# Altium schematic sheet output_register.schdoc
size 295 x 130 mm
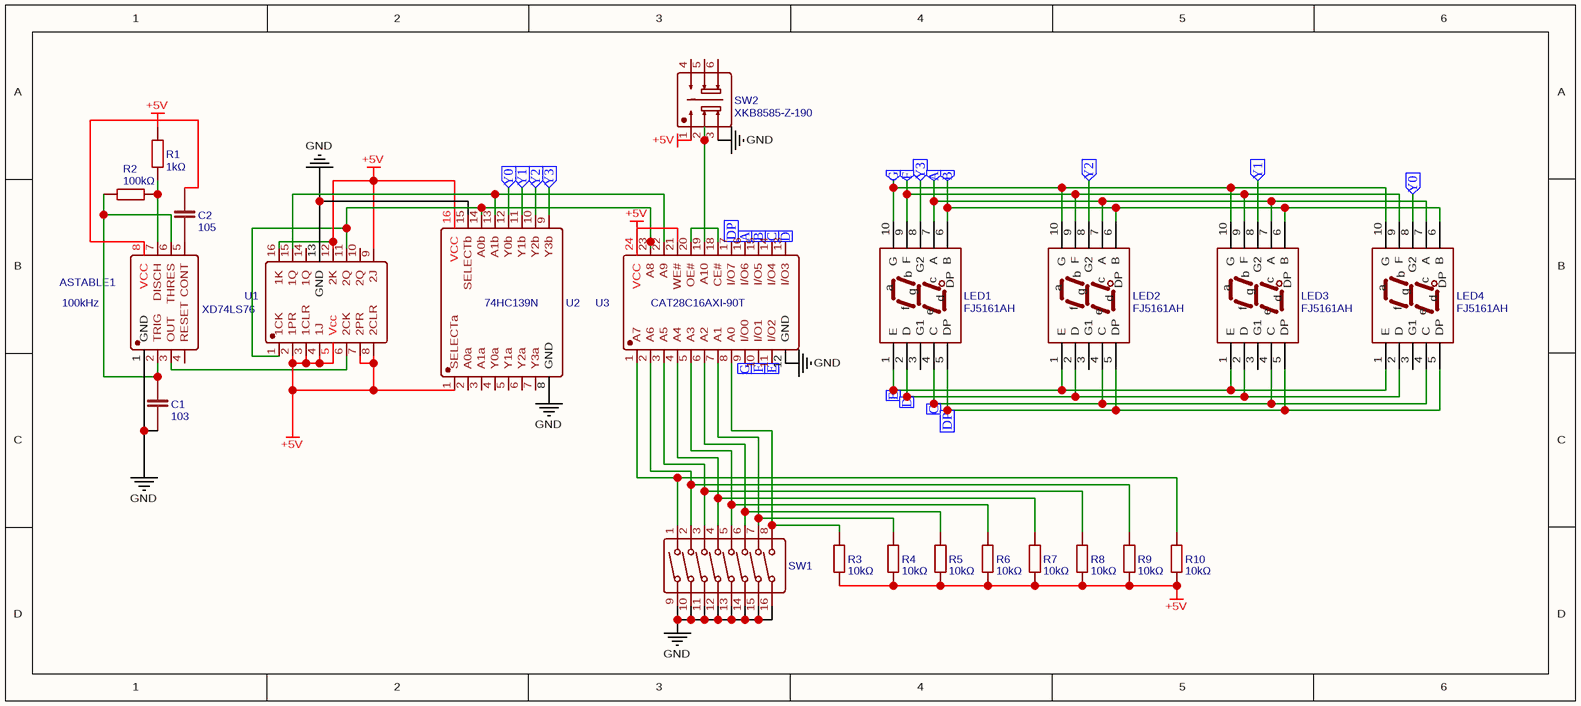
[diagram p0: output_register.schdoc]

## Parts
ASTABLE1  100kHz  [DIP-8_L9.8-W6.6-P2.54-LS7.6-BL]
C1  103  [CAPACITOR CERAMIC TH 0.1]
C2  105  [CAPACITOR CERAMIC TH 0.1]
LED1  FJ5161AH  [LED-SEG-TH_10P-L12.6-W19.0-P2.54-S15.24-BL]
LED2  FJ5161AH  [LED-SEG-TH_10P-L12.6-W19.0-P2.54-S15.24-BL]
LED3  FJ5161AH  [LED-SEG-TH_10P-L12.6-W19.0-P2.54-S15.24-BL]
LED4  FJ5161AH  [LED-SEG-TH_10P-L12.6-W19.0-P2.54-S15.24-BL]
R1  1kΩ  [RES-TH_BD3.3-L9.0-P13.00-D0.6]
R2  100kΩ  [RES-TH_BD3.3-L9.0-P13.00-D0.6]
R3  10kΩ  [RES-TH_BD3.3-L9.0-P13.00-D0.6]
R4  10kΩ  [RES-TH_BD3.3-L9.0-P13.00-D0.6]
R5  10kΩ  [RES-TH_BD3.3-L9.0-P13.00-D0.6]
R6  10kΩ  [RES-TH_BD3.3-L9.0-P13.00-D0.6]
R7  10kΩ  [RES-TH_BD3.3-L9.0-P13.00-D0.6]
R8  10kΩ  [RES-TH_BD3.3-L9.0-P13.00-D0.6]
R9  10kΩ  [RES-TH_BD3.3-L9.0-P13.00-D0.6]
R10  10kΩ  [RES-TH_BD3.3-L9.0-P13.00-D0.6]
SW1  DSWB08LHGET  [SW-TH_DSWB08LHGET]  (value not drawn)
SW2  XKB8585-Z-190  [SW-TH_6P-L8.6-W8.6-P2.50-LS5.4]
U1  XD74LS76  [DIP-16_L19.2-W6.6-P2.54-LS7.6-BL]
U2  74HC139N  [DIP-16_L19.2-W6.6-P2.54-LS7.6-BL]
U3  CAT28C16AXI-90T  [SOIC-24_L15.0-W5.3-P1.27-LS7.8-BL]

## Ports
A (in), B (in), C (in), D (in), DP (in), E (in), F (in), G (in), Y0 (in), Y1 (in), Y2 (in), Y3 (in)

## Nets
+5V: R1.2 R3.2 R4.2 R5.2 R6.2 R7.2 R8.2 R9.2 R10.2 SW2.1 U1.2(1PR) U1.3(1CLR) U1.4(1J) U1.5(Vcc) U1.7(2PR) U1.8(2CLR) U1.9(2J) U1.12(2K) U1.16(1K) U2.1(SELECTa) U2.16(VCC) U3.24(VCC)
GND: ASTABLE1.1(GND) C1.1 SW1.9 SW1.10 SW1.11 SW1.12 SW1.13 SW1.14 SW1.15 SW1.16 SW2.3 U1.1(1CK) U1.11(2Q) U1.13(GND) U2.8(GND) U2.14(A0b) U2.15(SELECTb) U3.12(GND) U3.23(A8)
A: LED1.7(A) LED2.7(A) LED3.7(A) LED4.7(A) U3.16(I/O6) ; port A
B: LED1.6(B) LED2.6(B) LED3.6(B) LED4.6(B) U3.15(I/O5) ; port B
C: LED1.4(C) LED2.4(C) LED3.4(C) LED4.4(C) U3.14(I/O4) ; port C
D: LED1.2(D) LED2.2(D) LED3.2(D) LED4.2(D) U3.13(I/O3) ; port D
DP: LED1.5(DP) LED2.5(DP) LED3.5(DP) LED4.5(DP) U3.17(I/O7) ; port DP
E: LED1.1(E) LED2.1(E) LED3.1(E) LED4.1(E) U3.11(I/O2) ; port E
F: LED1.9(F) LED2.9(F) LED3.9(F) LED4.9(F) U3.10(I/O1) ; port F
G: LED1.10(G) LED2.10(G) LED3.10(G) LED4.10(G) U3.9(I/O0) ; port G
Y0: LED4.8(G2) U2.12(Y0b) ; port Y0
Y1: LED3.8(G2) U2.11(Y1b) ; port Y1
Y2: LED2.8(G2) U2.10(Y2b) ; port Y2
Y3: LED1.8(G2) U2.9(Y3b) ; port Y3
NetASTABLE1_2: ASTABLE1.2(TRIG) ASTABLE1.6(THRES) C1.2 R2.2
NetASTABLE1_3: ASTABLE1.3(OUT) U1.6(2CK)
NetASTABLE1_5: ASTABLE1.5(CONT) C2.1
NetASTABLE1_7: ASTABLE1.7(DISCH) R1.1 R2.1
NetASTABLE1_8: ASTABLE1.8(VCC) C2.2
NetR3_1: R3.1 SW1.8 U3.8(A0)
NetR4_1: R4.1 SW1.7 U3.7(A1)
NetR5_1: R5.1 SW1.6 U3.6(A2)
NetR6_1: R6.1 SW1.5 U3.5(A3)
NetR7_1: R7.1 SW1.4 U3.4(A4)
NetR8_1: R8.1 SW1.3 U3.3(A5)
NetR9_1: R9.1 SW1.2 U3.2(A6)
NetR10_1: R10.1 SW1.1 U3.1(A7)
NetSW2_2: SW2.2 U3.19(A10)
NetU1_15: U1.15(1Q) U2.13(A1b) U3.22(A9)
NetU3_18: U3.18(CE#) U3.20(OE#)

Not connected (* = marked no-connect by the designer): ASTABLE1 4(RESET); LED1 3(G1); LED2 3(G1); LED3 3(G1); LED4 3(G1); SW2 4 5 6; U1 10(2Q) 14(1Q); U2 2(A0a) 3(A1a) 4(Y0a) 5(Y1a) 6(Y2a) 7(Y3a); U3 21(WE#)

## Notes on the sheet
- (in symbol FJ5161AH) b; c; a; g; d; f; e

## Library data of the parts
ASTABLE1 = 100kHz: Manufacturer: TI(德州仪器); Manufacturer Part: NE555P; nameAlias: Value; Supplier: LCSC; Supplier Part: C46749; JLCPCB Part Class: Extended Part; spicePre: U; spiceSymbolName: NE555P
C1 = 103: Pin Centres: 0.1; Contributor: MelDuckmanton; Component: Capacitor Ceramic TH 0.1; Mounting: TH; Manufacturer Part: ?; spicePre: C; spiceSymbolName: Capacitor Ceramic TH 0.1
C2 = 105: Pin Centres: 0.1; Contributor: MelDuckmanton; Component: Capacitor Ceramic TH 0.1; Mounting: TH; Manufacturer Part: ?; spicePre: C; spiceSymbolName: Capacitor Ceramic TH 0.1
LED1-LED4 = FJ5161AH: Manufacturer: 志浩; Supplier: LCSC; Manufacturer Part: FJ5161AH; Supplier Part: C8093; JLCPCB Part Class: Extended Part; spicePre: L; spiceSymbolName: FJ5161AH
R1 = 1kΩ: Manufacturer: CCO(千志电子); Manufacturer Part: MF1/2W-0.1Ω±1% T; nameAlias: Value; Contributor: LCSC; Supplier: LCSC; Supplier Part: C119393; JLCPCB Part Class: Extended Part; spicePre: R; spiceSymbolName: MF1/2W-0.1Ω±1% T52
R2 = 100kΩ: Manufacturer: CCO(千志电子); Manufacturer Part: MF1/2W-0.1Ω±1% T; nameAlias: Value; Contributor: LCSC; Supplier: LCSC; Supplier Part: C119393; JLCPCB Part Class: Extended Part; spicePre: R; spiceSymbolName: MF1/2W-0.1Ω±1% T52
R3-R10 = 10kΩ: Manufacturer: CCO(千志电子); Manufacturer Part: MF1/2W-0.1Ω±1% T; nameAlias: Value; Contributor: LCSC; Supplier: LCSC; Supplier Part: C119393; JLCPCB Part Class: Extended Part; spicePre: R; spiceSymbolName: MF1/2W-0.1Ω±1% T52
SW1 = DSWB08LHGET: Manufacturer: YE; Contributor: LCSC; Supplier: LCSC; Supplier Part: C99413; Manufacturer Part: DSWB08LHGET; JLCPCB Part Class: Extended Part; spicePre: S; spiceSymbolName: DSWB08LHGET
SW2 = XKB8585-Z-190: Manufacturer: XKB Connectivity(中国星坤); Contributor: LCSC; Supplier: LCSC; Supplier Part: C318849; Manufacturer Part: XKB8585-Z-190; JLCPCB Part Class: Extended Part; spicePre: S; spiceSymbolName: XKB8585-Z-190
U1 = XD74LS76: Manufacturer: XINLUDA(信路达); Contributor: LCSC; Supplier: LCSC; Supplier Part: C556289; Manufacturer Part: XD74LS76; JLCPCB Part Class: Extended Part; spicePre: U; spiceSymbolName: XD74LS76
U2 = 74HC139N: Manufacturer: HGSEMI(华冠); Contributor: LCSC; Supplier: LCSC; Supplier Part: C507187; Manufacturer Part: 74HC139N; JLCPCB Part Class: Extended Part; spicePre: U; spiceSymbolName: 74HC139N
U3 = CAT28C16AXI-90T: Manufacturer: onsemi(安森美); Contributor: lcsc; Supplier: LCSC; Supplier Part: C19304548; Manufacturer Part: CAT28C16AXI-90T; JLCPCB Part Class: Extended Part; spicePre: U; spiceSymbolName: CAT28C16AXI-90T